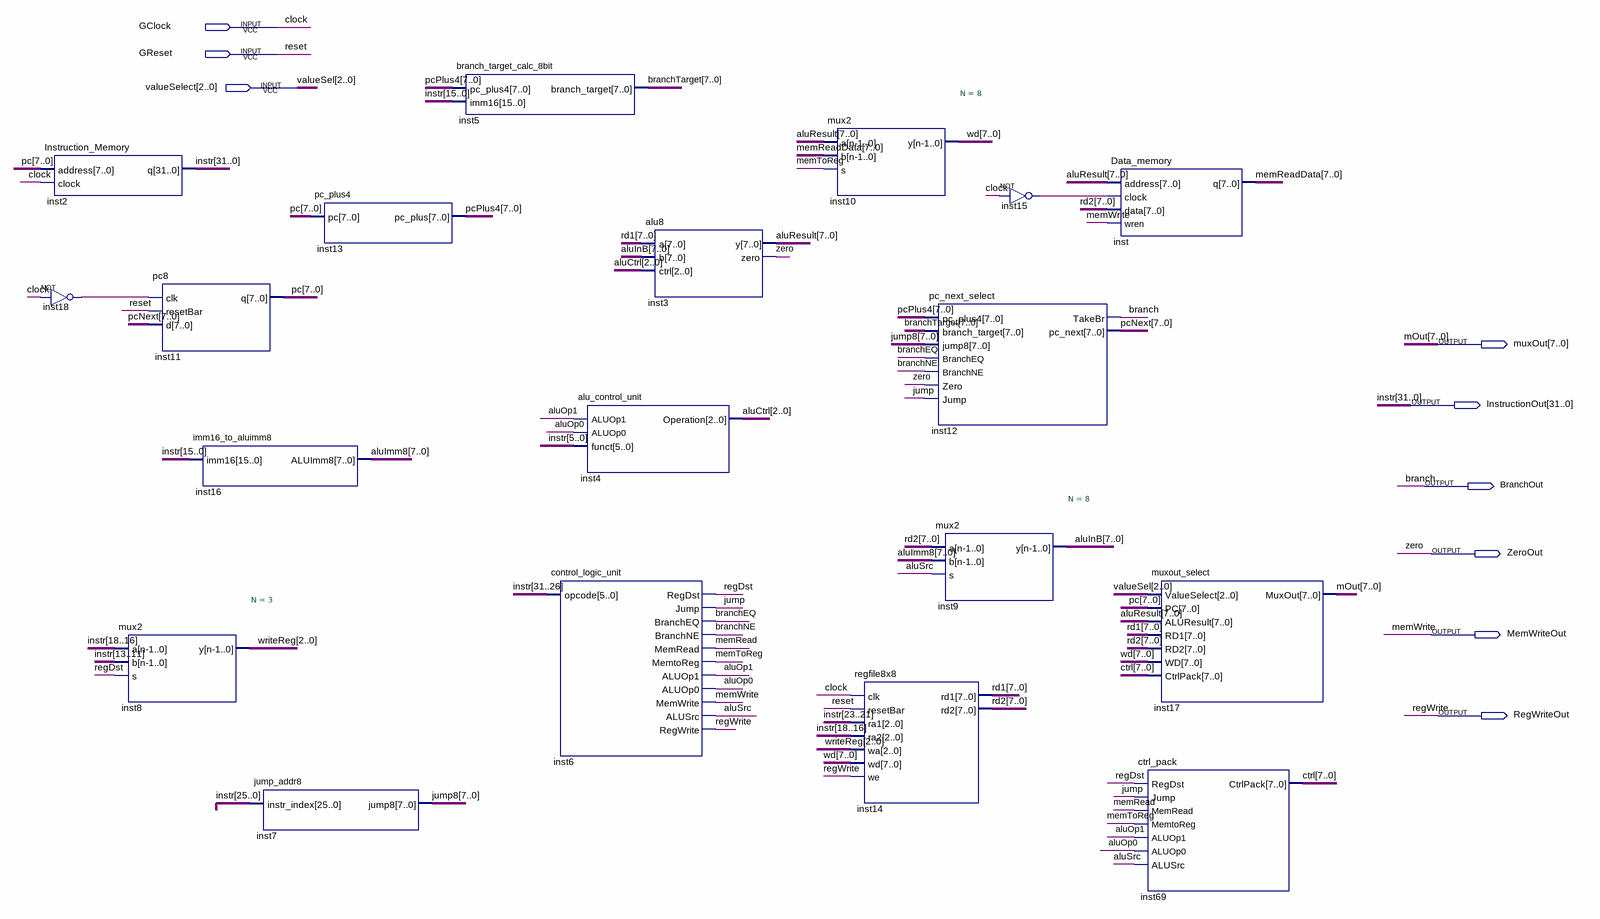
[diagram p0: schematic sheet]
// Quartus schematic top_level.bdf as structural Verilog: 19 symbols, 9 pins
module top_level (
  input  GClock,
  input  GReset,
  input  [2:0] valueSelect,
  output [7:0] muxOut,
  output [31:0] InstructionOut,
  output BranchOut,
  output ZeroOut,
  output MemWriteOut,
  output RegWriteOut
);

  wire aluOp0, aluOp1, aluSrc, branchEQ, branchNE, inst15_out, inst18_out, jump, memRead, memToReg, regDst;
  wire [2:0] aluCtrl, writeReg;
  wire [7:0] aluImm8, aluInB, aluResult, branchTarget, ctrl, jump8, memReadData, pc, pcNext, pcPlus4, rd1,
       rd2, wd;

  Instruction_Memory inst2 (.address(pc), .clock(GClock), .q(InstructionOut));
  not inst18 (inst18_out, GClock);
  pc8 inst11 (.clk(inst18_out), .resetBar(GReset), .d(pcNext), .q(pc));
  mux2 #(.N(3)) inst8 (.a(InstructionOut[18:16]), .b(InstructionOut[13:11]), .s(regDst), .y(writeReg));
  imm16_to_aluimm8 inst16 (.imm16(InstructionOut[15:0]), .ALUImm8(aluImm8));
  jump_addr8 inst7 (.instr_index(InstructionOut[25:0]), .jump8(jump8));
  pc_plus4 inst13 (.pc(pc), .pc_plus(pcPlus4));
  branch_target_calc_8bit inst5 (.pc_plus4(pcPlus4), .imm16(InstructionOut[15:0]), .branch_target(branchTarget));
  alu_control_unit inst4 (.ALUOp1(aluOp1), .ALUOp0(aluOp0), .funct(InstructionOut[5:0]), .Operation(aluCtrl));
  control_logic_unit inst6 (
    .opcode(InstructionOut[31:26]), .RegDst(regDst), .Jump(jump), .BranchEQ(branchEQ), .BranchNE(branchNE),
    .MemRead(memRead), .MemtoReg(memToReg), .ALUOp1(aluOp1), .ALUOp0(aluOp0), .MemWrite(MemWriteOut),
    .ALUSrc(aluSrc), .RegWrite(RegWriteOut));
  alu8 inst3 (.a(rd1), .b(aluInB), .ctrl(aluCtrl), .y(aluResult), .zero(ZeroOut));
  mux2 #(.N(8)) inst10 (.a(aluResult), .b(memReadData), .s(memToReg), .y(wd));
  regfile8x8 inst14 (
    .clk(GClock), .resetBar(GReset), .ra1(InstructionOut[23:21]), .ra2(InstructionOut[18:16]), .wa(writeReg),
    .wd(wd), .we(RegWriteOut), .rd1(rd1), .rd2(rd2));
  pc_next_select inst12 (
    .pc_plus4(pcPlus4), .branch_target(branchTarget), .jump8(jump8), .BranchEQ(branchEQ),
    .BranchNE(branchNE), .Zero(ZeroOut), .Jump(jump), .TakeBr(BranchOut), .pc_next(pcNext));
  mux2 #(.N(8)) inst9 (.a(rd2), .b(aluImm8), .s(aluSrc), .y(aluInB));
  not inst15 (inst15_out, GClock);
  Data_memory inst (.address(aluResult), .clock(inst15_out), .data(rd2), .wren(MemWriteOut), .q(memReadData));
  ctrl_pack inst69 (
    .RegDst(regDst), .Jump(jump), .MemRead(memRead), .MemtoReg(memToReg), .ALUOp1(aluOp1), .ALUOp0(aluOp0),
    .ALUSrc(aluSrc), .CtrlPack(ctrl));
  muxout_select inst17 (
    .ValueSelect(valueSelect), .PC(pc), .ALUResult(aluResult), .RD1(rd1), .RD2(rd2), .WD(wd),
    .CtrlPack(ctrl), .MuxOut(muxOut));

  // Other names for the same wires on the sheet: branch = BranchOut; clock = GClock; instr[31:0] = InstructionOut;
  //   memWrite = MemWriteOut; mOut[7:0] = muxOut; regWrite = RegWriteOut; reset = GReset; valueSel[2:0] = valueSelect;
  //   zero = ZeroOut
endmodule
